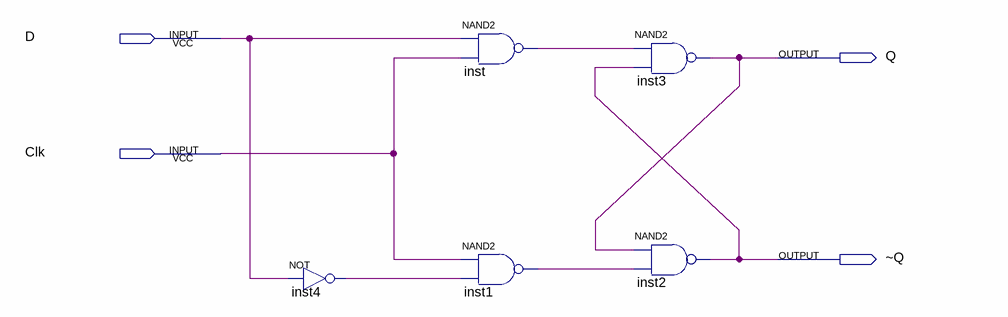
[diagram p0: schematic sheet]
// Quartus schematic Gated_D_Latch.bdf as structural Verilog: 5 symbols, 4 pins
module Gated_D_Latch (
  input  D,
  input  Clk,
  output Q,
  output \~Q 
);

  wire inst1_out, inst4_out, inst_out;

  not inst4 (inst4_out, D);
  nand inst (inst_out, D, Clk);
  nand inst1 (inst1_out, Clk, inst4_out);
  nand inst3 (Q, inst_out, \~Q );
  nand inst2 (\~Q , Q, inst1_out);
endmodule
